# Altium project ATTENUATOR.PrjPcb
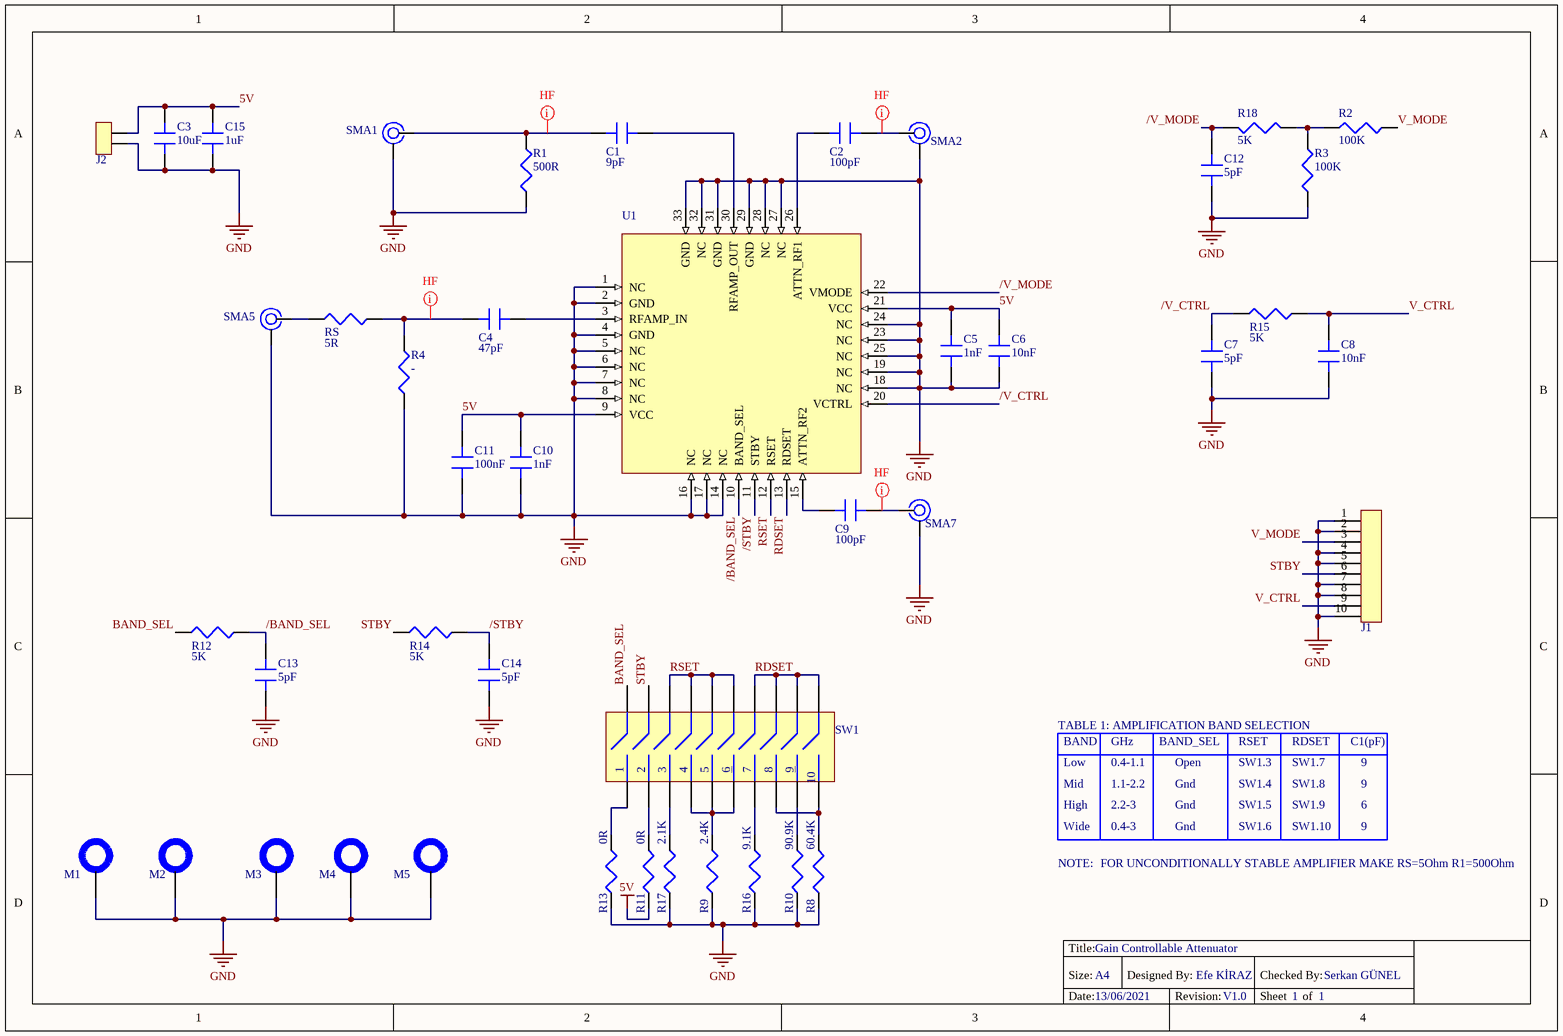
[diagram p0: ATTENUATOR_SCH.SchDoc]
1 sheet, 44 parts. Net scope: global (net labels, ports and power ports of the same name join across sheets).
Board file: ATTENUATOR_PCB.PcbDoc

## Sheet ATTENUATOR_SCH.SchDoc
size A4; SheetNumber: 1; SheetTotal: 1

### Parts
C1  9pF  [C0603]
C2  100pF  [C0603]
C3  10uF  [C_TANT_A]
C4  47pF  [C0603]
C5  1nF  [C0603]
C6  10nF  [C0603]
C7  5pF  [C0603]
C8  10nF  [C0603]
C9  100pF  [C0603]
C10  1nF  [C0603]
C11  100nF  [C0603]
C12  5pF  [C0603]
C13  5pF  [C0603]
C14  5pF  [C0603]
C15  1uF  [C0603]
J1  -  [IDC-2x05]  (value not drawn)
J2  -  [JST_XH_A_2]  (value not drawn)
M1  Mounting_Hole_NP  [MOUNTING_HOLE_NP_M3]  (value not drawn)
M2  Mounting_Hole_NP  [MOUNTING_HOLE_NP_M3]  (value not drawn)
M3  Mounting_Hole_NP  [MOUNTING_HOLE_NP_M3]  (value not drawn)
M4  Mounting_Hole_NP  [MOUNTING_HOLE_NP_M3]  (value not drawn)
M5  Mounting_Hole_NP  [MOUNTING_HOLE_NP_M3]  (value not drawn)
R1  500R  [R0603]
R2  100K  [R0603]
R3  100K  [R0603]
R4  -  [R0603]
R8  60.4K  [R0603]
R9  2.4K  [R0603]
R10  90.9K  [R0603]
R11  0R  [R0603]
R12  5K  [R0603]
R13  0R  [R0603]
R14  5K  [R0603]
R15  5K  [R0603]
R16  9.1K  [R0603]
R17  2.1K  [R0603]
R18  5K  [R0603]
RS  5R  [R0603]
SMA1  -  [SMA]  (value not drawn)
SMA2  -  [SMA]  (value not drawn)
SMA5  -  [SMA]  (value not drawn)
SMA7  -  [SMA]  (value not drawn)
SW1  DIP SW  [DIP20]  (value not drawn)
U1  F2480NBGI  [QFN50P500X500X80_HS-33N_2]  (value not drawn)

### Nets
5V: C3.1(-) C5.2(-) C6.2(-) C10.2(-) C11.2(-) C15.1(-) J2.2(-) R11.1(-) U1.9(VCC) U1.21(VCC)
GND: C3.2(-) C5.1(-) C6.1(-) C7.2(-) C8.1(-) C10.1(-) C11.1(-) C12.2(-) C13.2(-) C14.2(-) C15.2(-) J1.1 J1.2 J1.4 J1.5 J1.7 J1.8 J1.10 J2.1(-) M1.1 M2.1 M3.1 M4.1 M5.1 R1.1(-) R3.1(-) R4.1(-) R8.1(-) R9.1(-) R10.1(-) R13.1(-) R16.1(-) R17.1(-) SMA1.2(-) SMA2.2(-) SMA5.2(-) SMA7.2(-) U1.1(NC) U1.2(GND) U1.4(GND) U1.5(NC) U1.6(NC) U1.7(NC) U1.8(NC) U1.14(NC) U1.16(NC) U1.17(NC) U1.18(NC) U1.19(NC) U1.23(NC) U1.24(NC) U1.25(NC) U1.27(NC) U1.28(NC) U1.29(GND) U1.31(GND) U1.32(NC) U1.33(GND)
/BAND_SEL: C13.1(-) R12.2(-) U1.10(BAND_SEL)
/STBY: C14.1(-) R14.2(-) U1.11(STBY)
/V_CTRL: C7.1(-) R15.1(-) U1.20(VCTRL)
/V_MODE: C12.1(-) R18.1(-) U1.22(VMODE)
BAND_SEL: R12.1(-) SW1.1
RDSET: SW1.7 SW1.8 SW1.9 SW1.10 U1.13(RDSET)
RSET: SW1.3 SW1.4 SW1.5 SW1.6 U1.12(RSET)
STBY: J1.6 R14.1(-) SW1.2
V_CTRL: C8.2(-) J1.9 R15.2(-)
V_MODE: J1.3 R2.1(-)
NetC1_1: C1.1(-) R1.2(-) SMA1.1(-)
NetC1_2: C1.2(-) U1.30(RFAMP_OUT)
NetC2_1: C2.1(-) U1.26(ATTN_RF1)
NetC2_2: C2.2(-) SMA2.1(-)
NetC4_1: C4.1(-) R4.2(-) RS.2(-)
NetC4_2: C4.2(-) U1.3(RFAMP_IN)
NetC9_1: C9.1(-) U1.15(ATTN_RF2)
NetC9_2: C9.2(-) SMA7.1(-)
NetR2_2: R2.2(-) R3.2(-) R18.2(-)
NetR8_2: R8.2(-) SW1.11 SW1.13
NetR9_2: R9.2(-) SW1.15 SW1.16 SW1.17
NetR10_2: R10.2(-) SW1.12
NetR11_2: R11.2(-) SW1.19
NetR13_2: R13.2(-) SW1.20
NetR16_2: R16.2(-) SW1.14
NetR17_2: R17.2(-) SW1.18
NetRS_1: RS.1(-) SMA5.1(-)

### Layout directives
mark named HF: NetC1_1, NetC2_2, NetC4_1, NetC9_2

### Notes on the sheet
- TABLE 1: AMPLIFICATION BAND SELECTION
- BAND
- Low
- Mid
- GHz
- 0.4-1.1
- 1.1-2.2
- BAND_SEL
- Open
- Gnd
- RSET
- SW1.3
- SW1.4
- RDSET
- SW1.7
- SW1.8
- C1(pF)
- 9
- High
- Wide
- 2.2-3
- 0.4-3
- SW1.5
- SW1.6
- SW1.9
- SW1.10
- 6
- NOTE:
- FOR UNCONDITIONALLY STABLE AMPLIFIER MAKE RS=5Ohm R1=500Ohm
- Title:
- Size:
- Gain Controllable Attenuator
- A4
- Designed By:
- Efe KİRAZ
- Checked By:
- Serkan GÜNEL
- Date:
- 13/06/2021
- Revision:
- V1.0
- Sheet
- 1
- of

### Library data of the parts
C1-C15 = C
J1 = Conn_Gene_1x10
J2 = Conn_Gene_1x02
M1-M5 = MOUNTING_HOLE: Non-Plated
R1-R4 R8-R18 RS = R
SMA1 SMA2 SMA5 SMA7 = SMA